# EAGLE design TinyBuddy-rev1 (EAGLE 6.5.0)
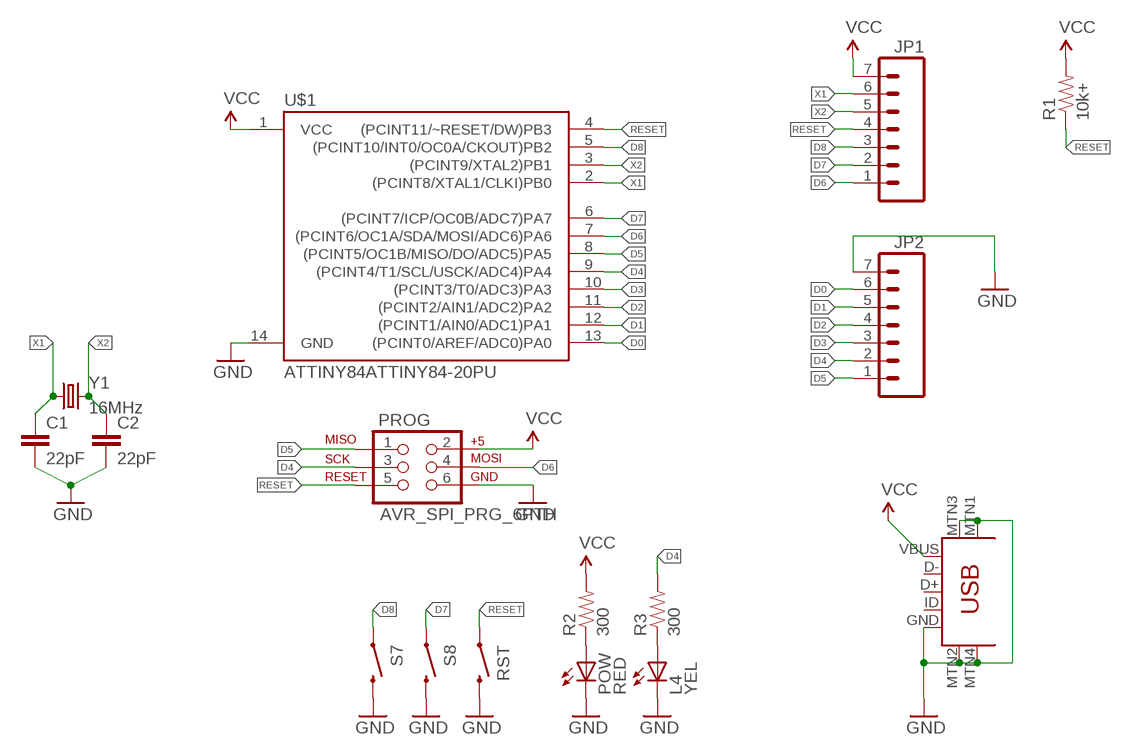
[diagram p0: schematic, sheet 1]

## Parts
C1  22pF  CAPPTH  [CAP-PTH-SMALL]
C2  22pF  CAPPTH  [CAP-PTH-SMALL]
JP1  M07NOSILK  [1X07_NOSILK]
JP2  M07NOSILK  [1X07_NOSILK]
L4  YEL  LED3MM  [LED3MM]
POW  RED  LED3MM  [LED3MM]
PROG  AVR_SPI_PRG_6PTH  [2X3]
R1  10k+  RESISTORPTH-1/6W  [1/6W-RES]
R2  300  RESISTORPTH-1/6W  [1/6W-RES]
R3  300  RESISTORPTH-1/6W  [1/6W-RES]
RST  SWITCH-MOMENTARY-2PTH  [TACTILE-PTH]
S7  SWITCH-MOMENTARY-2PTH  [TACTILE-PTH]
S8  SWITCH-MOMENTARY-2PTH  [TACTILE-PTH]
U$1  ATTINY84ATTINY84-20PU  [DIL14]
U$2  USB-MINIB-5PIN  [USB-MINIB]
Y1  16MHz  CRYSTALHC49US  [HC49US]

## Nets
D0: JP2.6 U$1.13((PCINT0/AREF/ADC0)PA0)
D1: JP2.5 U$1.12((PCINT1/AIN0/ADC1)PA1)
D2: JP2.4 U$1.11((PCINT2/AIN1/ADC2)PA2)
D3: JP2.3 U$1.10((PCINT3/T0/ADC3)PA3)
D4: JP2.2 PROG.3 R3.2 U$1.9((PCINT4/T1/SCL/USCK/ADC4)PA4)
D5: JP2.1 PROG.1 U$1.8((PCINT5/OC1B/MISO/DO/ADC5)PA5)
D6: JP1.1 PROG.4 U$1.7((PCINT6/OC1A/SDA/MOSI/ADC6)PA6)
D7: JP1.2 S8.1 U$1.6((PCINT7/ICP/OC0B/ADC7)PA7)
D8: JP1.3 S7.1 U$1.5((PCINT10/INT0/OC0A/CKOUT)PB2)
GND: C1.2 C2.2 JP2.7 L4.K(C) POW.K(C) PROG.6 RST.3 S7.3 S8.3 U$1.14(GND) U$2.GND U$2.MTN1(MTN2) U$2.MTN2(MTN3) U$2.MTN3(MTN1) U$2.MTN4
N$1: POW.A R2.1
N$2: L4.A R3.1
RESET: JP1.4 PROG.5 R1.1 RST.1 U$1.4((PCINT11/~RESET/DW)PB3)
VCC: JP1.7 PROG.2 R1.2 R2.2 U$1.1(VCC) U$2.VBUS
X1: C1.1 JP1.6 U$1.2((PCINT8/XTAL1/CLKI)PB0) Y1.1
X2: C2.1 JP1.5 U$1.3((PCINT9/XTAL2)PB1) Y1.2
Unconnected: U$2.D+ U$2.D- U$2.ID

## Library data of the parts
C1 C2 = SparkFun-Capacitors:CAP: Capacitor Standard 0603 ceramic capacitor, and 0.1" leaded capacitor.
JP1 JP2 = SparkFun-Connectors:M07: Header 7 Standard 7-pin 0.1" header. Use with straight break away headers (SKU : PRT-00116), right angle break away headers (PRT-00553), swiss pins (PRT-00743), machine pins (PRT-00117), and female headers (PRT-00115). NOTES ON THE VARIANTS LOCK and LOCK_LONGPADS... This footprint was designed to help hold the alignment of a through-hole component (i.e. 7-pin header) while soldering it into place. You may notice that each hole has been shifted either up or down by 0.005 of an inch from it's more standard position (which is usually a perfectly straight line). This slight alteration caused the pins (the squares in the middle) to touch the edges of the holes. Because they are alternating, it causes a "brace" to hold the header in place. 0.005 has proven to be the perfect amount of "off-center" position when using our standard breakaway headers. Although looks a little odd when you look at the bare footprint, once you have a header in there, the alteration is very hard to notice. Also, if you push a header all the way into place, it is covered up entirely on the bottom side. This idea of altering the position of holes to aid alignment will be further integrated into the Sparkfun Library for other footprints. It can help hold any component with 3 or more connection pins.
L4 POW = SparkFun-LED:LED: LEDs Standard schematic elements and footprints for 5mm, 3mm, 1206, and 0603 sized LEDs. 5mm - Spark Fun Electronics SKU : COM-00529 (and others)
PROG = SparkFun-Connectors:AVR_SPI_PRG_6: AVR ISP 6 Pin This is the reduced ISP connector for AVR programming. Common on Arduino. This footprint will take up less PCB space and can be used with a 10-pin to 6-pin adapter such as SKU: BOB-08508
R1-R3 = SparkFun-Resistors:RESISTOR: Resistor Basic schematic elements and footprints for 0603, 1206, and PTH resistors.
RST S7 S8 = SparkFun-Electromechanical:SWITCH-MOMENTARY-2: Various NO switches- pushbuttons, reed, etc
U$1 = SparkFun-DigitalIC:ATTINY84: Atmel 14-pin 2/4/8kB flash uC
U$2 = SparkFun-Connectors:USB-MINIB: Mini-USB "B" connector with 5th pin broken out. Created new symbol breaking out 5th "ID" pin in mini/micro USB connector spec. See: http://en.wikipedia.org/wiki/Mini_usb#Cables. Uses same footprint as 4-pin symbol. Also added pins to connect to mounting / shield pads if required (probably not generally needed as signals aren't shielded once they leave the connector).
Y1 = SparkFun-FreqCtrl:CRYSTAL: Various standard crystals. Proven footprints. Spark Fun Electronics SKU : COM-00534

## Board
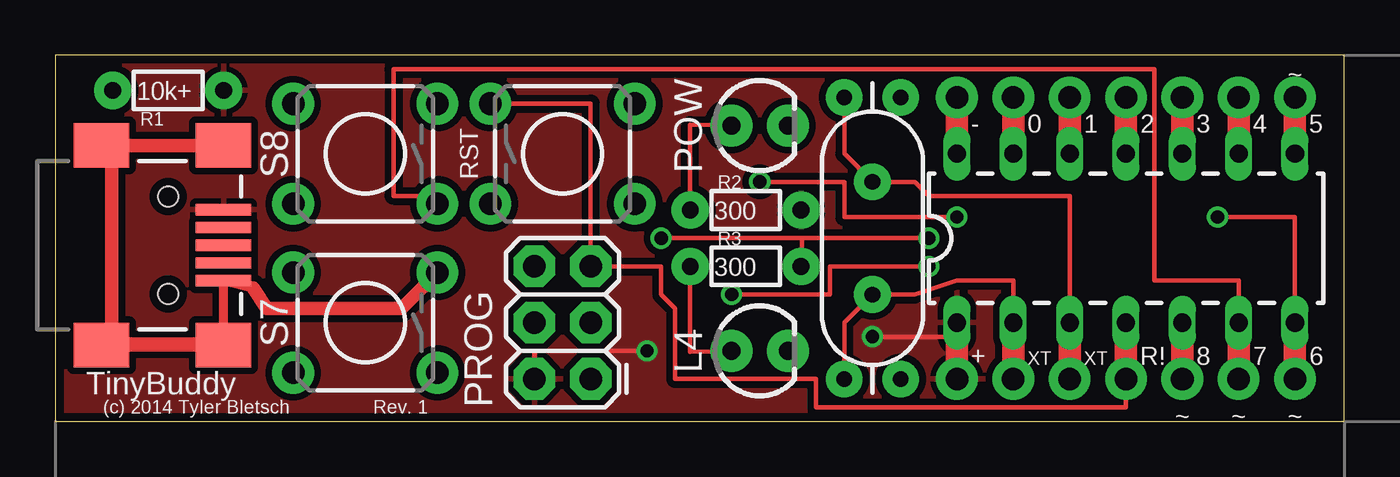
[diagram p1: board, top side]
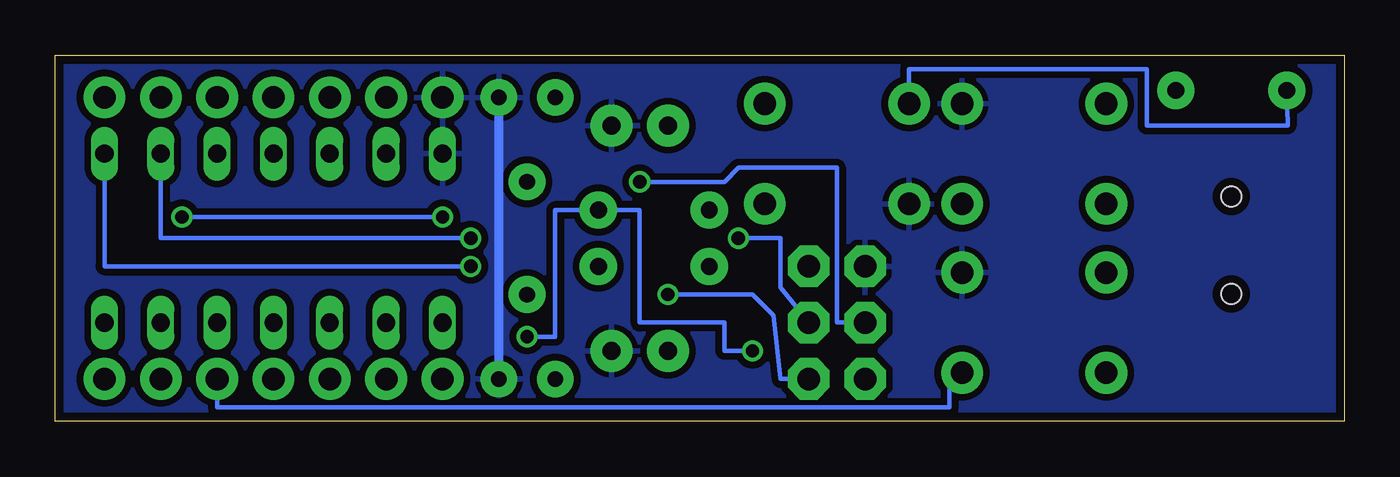
[diagram p2: board, bottom side, seen from below]

Size 58.09 x 16.5 mm. Coordinates in mm from the lower left corner, seen from the top.
Outline: 0,0 58.09,0 58.09,16.5 0,16.5 0,0
Copper layers (1*16): Top 0.0356mm / dielectric 1.5011mm / Bottom 0.0356mm
Design rules "OSH-Park-PCBOrder": minimum track width 6mil, minimum drill 13mil, track to track 6mil, track to pad 6mil, pad to pad 6mil, via to via 6mil, smd to smd 6mil, copper to edge 15mil, drill to drill 6mil, minimum pad ring 7mil, minimum via ring 7mil, stop-mask expansion 3mil, vias tented up to drill 0mil, thermal gap 10mil

### Footprints (pad centres in the part's own frame; a part is rotated, then mirrored left to right if it is on the bottom)
CAP-PTH-SMALL = drill 0.7 pad 1.651: 1 0,0; 2 2.54,0
1X07_NOSILK = drill 1.016 pad 1.88: 1 0,0; 2 2.54,0; 3 5.08,0; 4 7.62,0; 5 10.16,0; 6 12.7,0; 7 15.24,0
LED3MM = drill 0.813 pad 1.88: A -1.27,0; K 1.27,0
2X3 = drill 1.016 pad 1.88 octagon: 1 0,0; 2 0,2.54; 3 2.54,0; 4 2.54,2.54; 5 5.08,0; 6 5.08,2.54
1/6W-RES = drill 0.762 pad 1.676: 1 -2.5,0; 2 2.5,0
TACTILE-PTH = drill 1.016 pad 1.88: 1 -3.251,2.261; 2 3.251,2.261; 3 -3.251,-2.261; 4 3.251,-2.261
DIL14 = drill 0.813 long: 1 -8.89,-3.81; 2 -6.35,-3.81; 3 -3.81,-3.81; 4 -1.27,-3.81; 5 1.27,-3.81; 6 3.81,-3.81; 7 6.35,-3.81; 8 6.35,3.81; 9 3.81,3.81; 10 1.27,3.81; 11 -1.27,3.81; 12 -3.81,3.81; 13 -6.35,3.81; 14 -8.89,3.81
USB-MINIB = smd 2.5 x 0.5: D+ 2.5,0; D- 2.5,0.8; GND 2.5,-1.6; ID 2.5,-0.8; VBUS 2.5,1.6 | smd 2.5 x 2: MTN1 -3,4.5; MTN2 2.5,4.5; MTN3 -3,-4.5; MTN4 2.5,-4.5 | hole 0.9: 0,2.2; 0,-2.2
HC49US = drill 0.7 pad 1.651: 1 -2.54,0; 2 2.54,0

### Placement (x,y rotation side)
C1  35.56,1.91 0 top
C2  35.56,14.61 0 top
JP1  55.88,1.91 180 top
JP2  55.88,14.61 180 top
L4  31.75,3.18 0 top
POW  31.75,13.34 0 top
PROG  24.13,1.91 90 top
R1  5.08,14.92 0 top
R2  31.11,9.52 0 top
R3  31.11,6.98 0 top
RST  22.86,12.07 0 top
S7  13.97,4.45 180 top
S8  13.97,12.07 180 top
U$1  49.53,8.25 0 top
U$2  5.08,7.94 0 top
Y1  36.83,8.25 90 top

### Tracks (layer width: path | path; a pad name or v marks a point on that pad's centre or on a via)
D0
  Top 1.016: U$1.13 JP2.6
D1
  Top 1.016: JP2.5 U$1.12
D2
  Top 1.016: U$1.11 JP2.4
D3
  Top 1.016: JP2.3 U$1.10
D4  (via drill 0.6)
  Top 0.203: v27.3,8.25 33.66,8.25 | 33.66,8.25 v39.37,8.25 | R3.2 33.66,6.98 33.66,8.25
  Top 1.016: U$1.9 JP2.2
  Bottom 0.203: PROG.3 25.4,6.03 25.4,8.25 v27.3,8.25 | U$1.9 53.34,8.25 v39.37,8.25
D5  (via drill 0.6)
  Top 0.203: v39.37,6.98 34.92,6.98 34.92,5.71 v30.48,5.71
  Top 1.016: JP2.1 U$1.8
  Bottom 0.203: U$1.8 55.88,6.98 v39.37,6.98 | v30.48,5.71 26.67,5.71 25.72,4.76 25.4,1.91 PROG.1
D6  (via drill 0.6)
  Top 0.203: U$1.7 55.88,9.21 v52.39,9.21 | v40.64,9.21 35.56,9.21 35.56,10.8 v31.75,10.8
  Top 1.016: JP1.1 U$1.7
  Bottom 0.203: v52.39,9.21 v40.64,9.21 | v31.75,10.8 27.94,10.8 27.3,11.43 22.86,11.43 22.86,4.45 PROG.4
D7
  Top 0.203: U$1.6 53.34,6.35 49.53,6.35 49.53,15.88 15.24,15.88 15.24,10.16 17.22,10.16 S8.1
  Top 1.016: JP1.2 U$1.6
D8
  Top 1.016: JP1.3 U$1.5
  Bottom 0.203: S7.1 17.78,2.18 17.78,0.64 50.8,0.64 JP1.3
GND
  Top 0.406: 8.9,6.02 U$2.GND 7.58,3.49 U$2.MTN4
  Top 0.61: 8.9,6.02 9.52,5.08 15.6,5.08 S7.3 | U$2.MTN4 U$2.MTN3 | U$2.MTN1 2.54,12.44 | U$2.MTN2 2.54,12.44 | 2.54,12.44 2.54,3.49 7.58,3.49
  Top 1.016: JP2.7 U$1.14
  Bottom 0.406: C1.2 C2.2
  pour Bottom (isolate 0.305): -2.54,19.69 -2.54,-1.9 59.69,-1.9 59.69,18.41
N$1
  Top 0.203: R2.1 28.61,13.38 POW.A
N$2
  Top 0.203: R3.1 28.61,3.14 L4.A
RESET
  Top 0.203: RST.1 24.13,14.33 PROG.5 27.3,6.98 27.3,5.71 27.94,5.08 27.94,1.91 34.29,1.91 34.29,0.64 48.26,0.64 JP1.4
  Top 1.016: JP1.4 U$1.4
  Bottom 0.203: R1.1 2.54,13.34 8.89,13.34 8.89,15.88 19.61,15.88 RST.1
VCC  (via drill 0.6)
  Top 0.203: v36.83,3.81 40.64,3.81 U$1.1 | PROG.2 21.59,3.18 v26.67,3.18
  Top 1.016: U$1.1 JP1.7
  Bottom 0.203: v36.83,3.81 35.56,3.81 35.56,9.52 R2.2 31.75,9.52 31.75,4.45 27.94,4.45 27.94,3.18 v26.67,3.18
  pour Top (isolate 0.305): -1.27,18.41 58.42,17.15 58.42,-0.63 -1.27,-0.63
X1
  Top 0.203: U$1.2 43.18,6.35 40.64,6.35 38.73,5.71 Y1.1 35.56,4.45 C1.1
  Top 1.016: JP1.6 U$1.2
X2
  Top 0.203: U$1.3 45.72,10.16 39.37,10.16 38.73,10.8 Y1.2 35.56,12.07 C2.1
  Top 1.016: U$1.3 JP1.5

### Text on the board
tPlace: ~ | - | 0 | 1 | 2 | 3 | 4 | 5 | TinyBuddy | + | XT | XT | R! | 8 | 7 | 6 | (c) 2014 Tyler Bletsch | Rev. 1 | ~ | ~ | ~